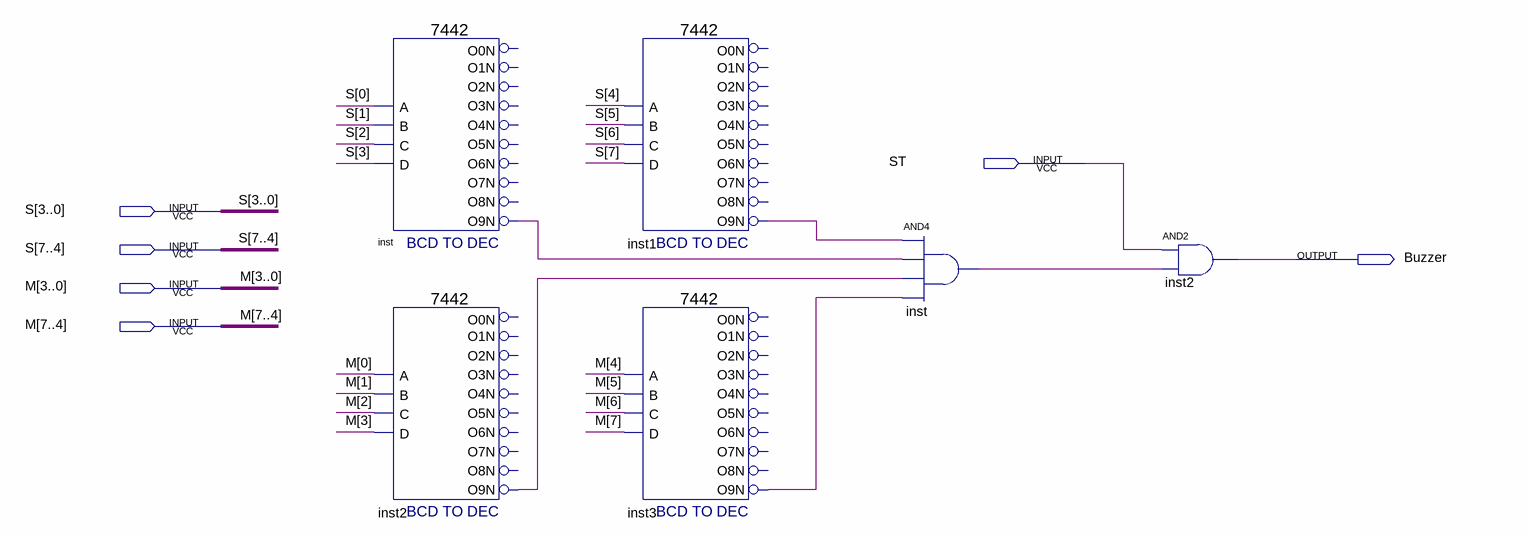
[diagram p0: schematic sheet]
// Quartus schematic Buzzer.bdf as structural Verilog: 6 symbols, 6 pins
module Buzzer (
  input  ST,
  input  [7:0] S,
  input  [7:0] M,
  output Buzzer
);

  wire inst1_o9n, inst2_o9n, inst3_o9n, inst_o9n, inst_out;

  \7442  inst (
    .D(S[3]), .B(S[1]), .C(S[2]), .A(S[0]), .O9N(inst_o9n));  // open: O7N, O8N, O0N, O3N, O2N, O1N, O6N, O5N, O4N
  \7442  inst2 (
    .D(M[3]), .B(M[1]), .C(M[2]), .A(M[0]), .O9N(inst2_o9n));  // open: O7N, O8N, O0N, O3N, O2N, O1N, O6N, O5N, O4N
  \7442  inst1 (
    .D(S[7]), .B(S[5]), .C(S[6]), .A(S[4]), .O9N(inst1_o9n));  // open: O7N, O8N, O0N, O3N, O2N, O1N, O6N, O5N, O4N
  \7442  inst3 (
    .D(M[7]), .B(M[5]), .C(M[6]), .A(M[4]), .O9N(inst3_o9n));  // open: O7N, O8N, O0N, O3N, O2N, O1N, O6N, O5N, O4N
  and inst_dup2 (inst_out, inst1_o9n, inst_o9n, inst2_o9n, inst3_o9n);
  and inst2_dup2 (Buzzer, ST, inst_out);
endmodule
